# EAGLE design ePaper_1.54_v1.0.1 (EAGLE 9.6.1)

## Sheet 1 of 4: USB & LDO
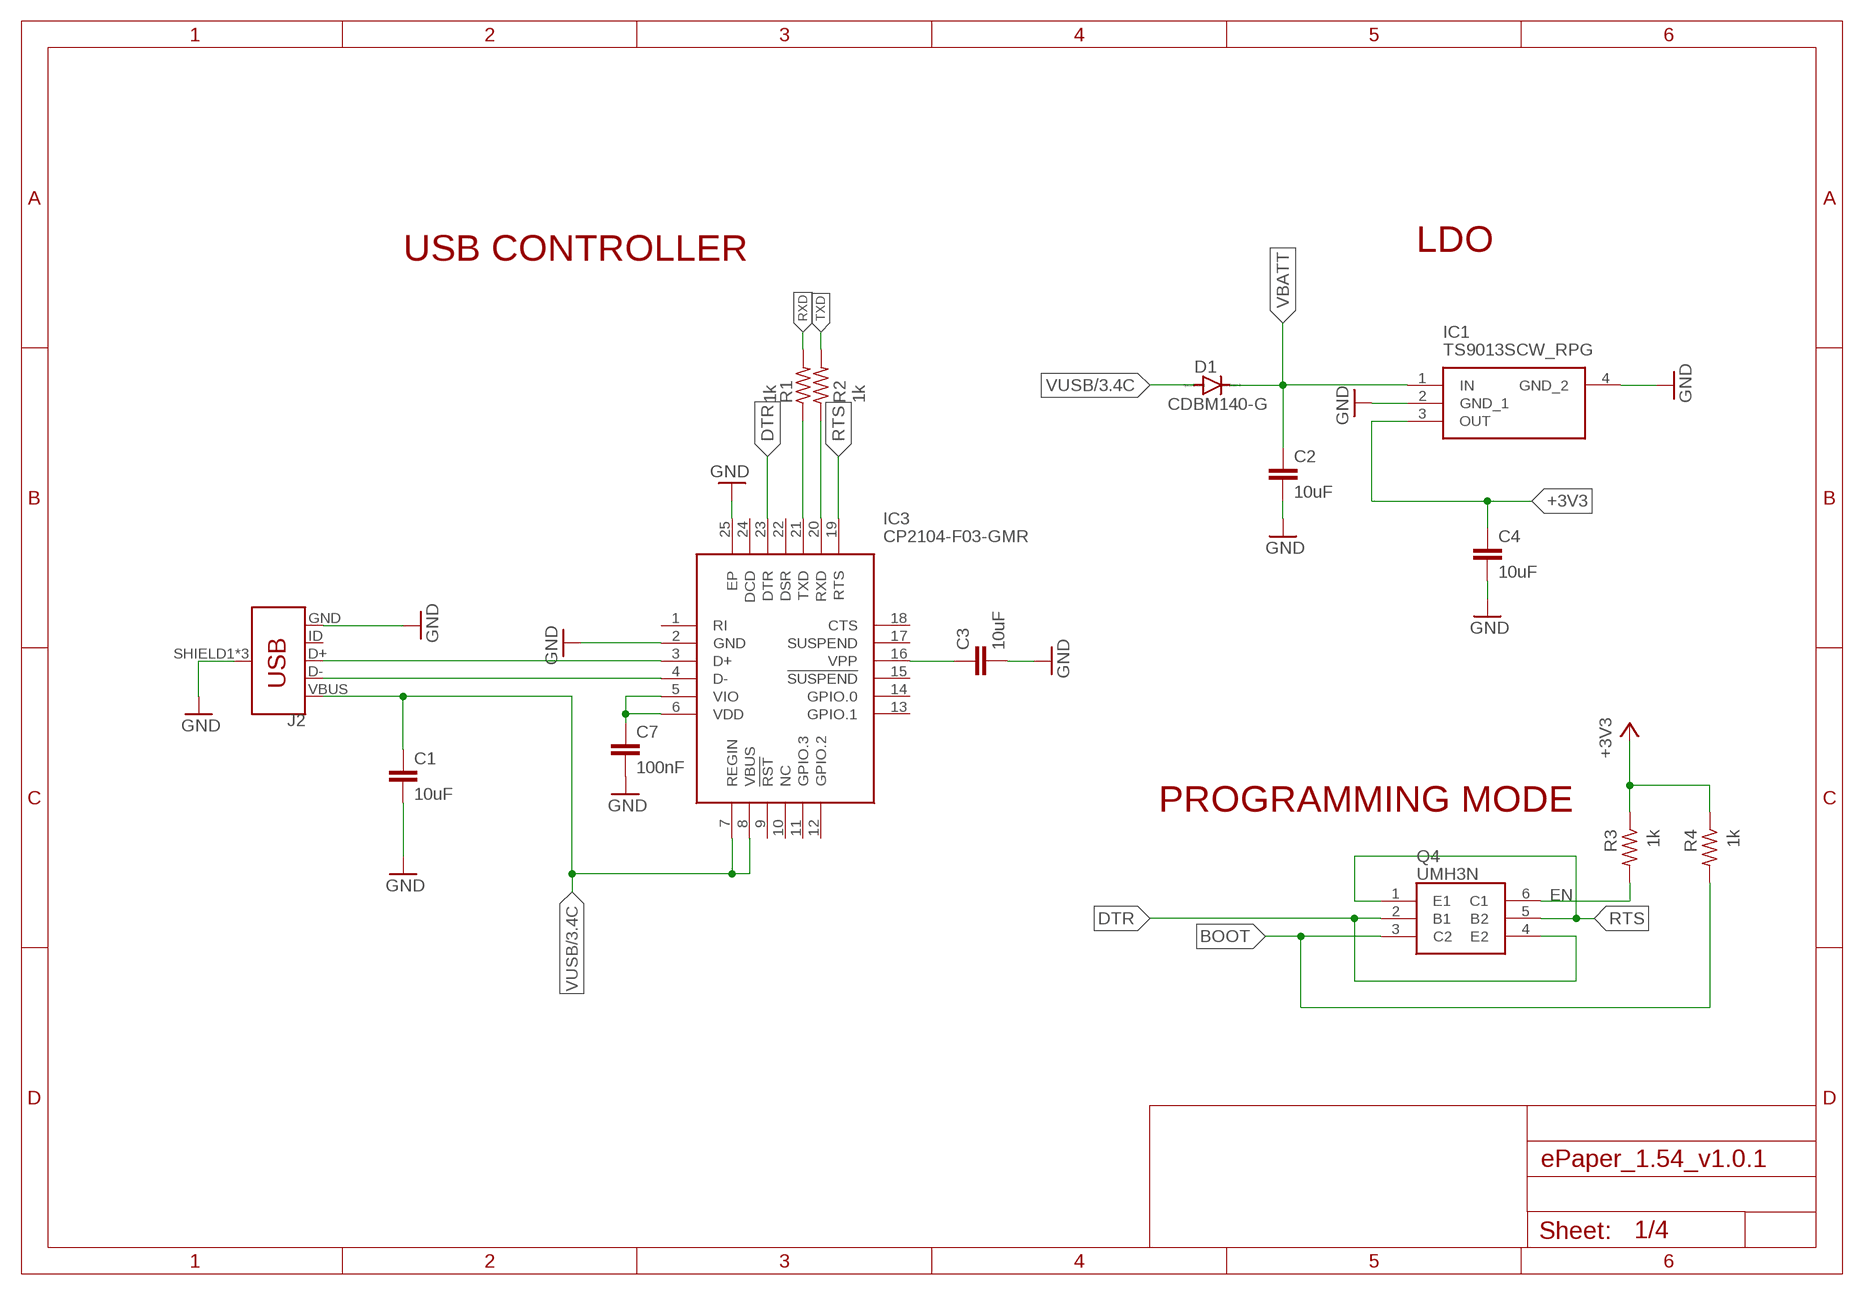
[diagram p0: schematic, sheet 1]

### Parts
C1  10uF  C-EUC0603  [C0603]
C2  10uF  C-EUC0603  [C0603]
C3  10uF  C-EUC0603  [C0603]
C4  10uF  C-EUC0603  [C0603]
C7  100nF  C-EUC0603  [C0603]
D1  CDBM140-G  DIODE-SOD123  [SOD123]
IC1  TS9013SCW_RPG  [SOT230P700X180-4N]
IC3  CP2104-F03-GMR  [QFN50P400X400X80-25N]
J2  USB_MICRO-B_FEMALE-SMT  [USB-B-MICRO-SMD]
Q4  UMH3N  [SOT65P230X110-6N]
R1  1k  R-US_R0603  [R0603]
R2  1k  R-US_R0603  [R0603]
R3  1k  R-US_R0603  [R0603]
R4  1k  R-US_R0603  [R0603]

### Nets
+3V3: C4.1 IC1.3(OUT) R3.1 R4.1 ; also sheet 2,4
BOOT: Q4.3(C2) R4.2 ; also sheet 2
DTR: IC3.23(DTR) Q4.2(B1) Q4.4(E2)
EN: Q4.6(C1) R3.2 ; also sheet 2
GND: C1.2 C2.2 C3.2 C4.2 C7.2 IC1.2(GND_1) IC1.4(GND_2) IC3.2(GND) IC3.25(EP) J2.GND J2.SHIELD1(SHIELD) J2.SHIELD2(SHIELD) J2.SHIELD3(SHIELD) ; also sheet 2,3,4
N$1: IC3.3(D+) J2.D+
N$2: IC3.4(D-) J2.D-
N$3: C3.1 IC3.16(VPP)
N$5: C7.1 IC3.5(VIO) IC3.6(VDD)
N$8: IC3.20(RXD) R2.1
N$9: IC3.21(TXD) R1.1
RTS: IC3.19(RTS) Q4.1(E1) Q4.5(B2)
RXD: R1.2 ; also sheet 2
TXD: R2.2 ; also sheet 2
VBATT: C2.1 D1.C IC1.1(IN) ; also sheet 2,3
VUSB: C1.1 D1.A IC3.7(REGIN) IC3.8(VBUS) J2.VBUS ; also sheet 3
Unconnected: IC3.1(RI) IC3.9(!RST) IC3.10(NC) IC3.11(GPIO.3) IC3.12(GPIO.2) IC3.13(GPIO.1) IC3.14(GPIO.0) IC3.15(!SUSPEND) IC3.17(SUSPEND) IC3.18(CTS) IC3.22(DSR) IC3.24(DCD) J2.ID

### Notes on the sheet
- USB CONTROLLER | LDO
- PROGRAMMING MODE

## Sheet 2 of 4: MICROCONTROLLER
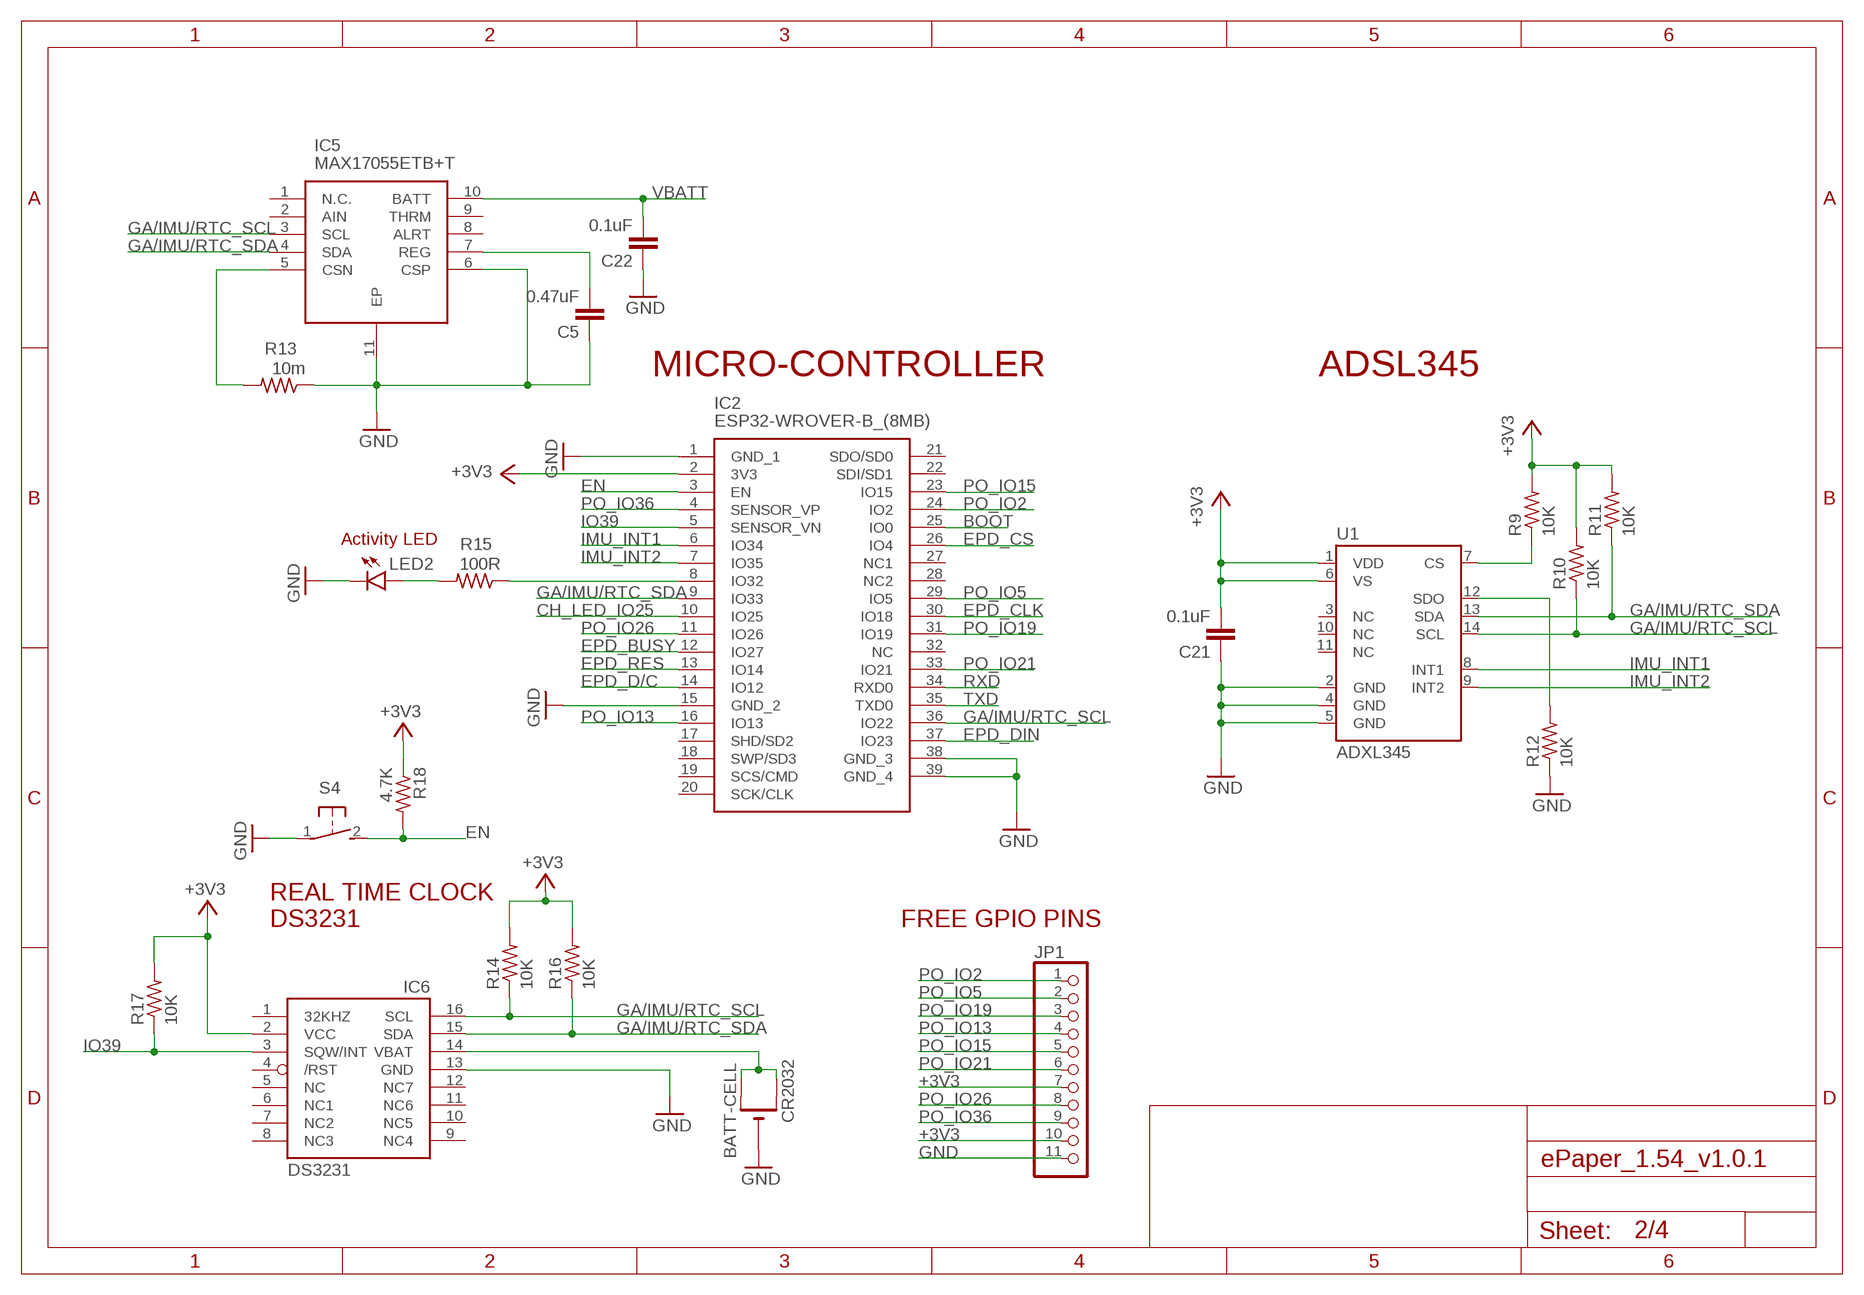
[diagram p1: schematic, sheet 2]

### Parts
BATT-CELL  CR2032  CR2032SMT  [CR2032-SMD]
C5  0.47uF  C-EUC0603  [C0603]
C21  0.1uF  C-EUC0603  [C0603]
C22  0.1uF  C-EUC0603  [C0603]
IC2  ESP32-WROVER-B_(8MB)  [ESP32WROVERIB8MB]
IC5  MAX17055ETB+T  [SON40P250X200X80-11N]
IC6  DS3231/SO  [SO16W]
JP1  PINHD-1X11_2.54-S  [1X11-S]
LED2  LEDCHIPLED_0805  [CHIPLED_0805]
R9  10K  R-US_R0603  [R0603]
R10  10K  R-US_R0603  [R0603]
R11  10K  R-US_R0603  [R0603]
R12  10K  R-US_R0603  [R0603]
R13  10m  R-US_R0603  [R0603]
R14  10K  R-US_R0603  [R0603]
R15  100R  R-US_R0603  [R0603]
R16  10K  R-US_R0603  [R0603]
R17  10K  R-US_R0603  [R0603]
R18  4.7K  R-US_R0603  [R0603]
S4  31-XX  [B3F-31XX]
U1  ADXL345  [LGA14]

### Nets
+3V3: C21.2 IC2.2(3V3) IC6.2(VCC) JP1.7 JP1.10 R9.2 R10.2 R11.2 R14.2 R16.2 R17.2 R18.1 U1.1(VDD) U1.6(VS) ; also sheet 1,4
BOOT: IC2.25(IO0) ; also sheet 1
CH_LED_IO25: IC2.10(IO25) ; also sheet 3
EN: IC2.3(EN) R18.2 S4.2(S) ; also sheet 1
EPD_BUSY: IC2.12(IO27) ; also sheet 4
EPD_CLK: IC2.30(IO18) ; also sheet 4
EPD_CS: IC2.26(IO4) ; also sheet 4
EPD_D/C: IC2.14(IO12) ; also sheet 4
EPD_DIN: IC2.37(IO23) ; also sheet 4
EPD_RES: IC2.13(IO14) ; also sheet 4
GA/IMU/RTC_SCL: IC2.36(IO22) IC5.3(SCL) IC6.16(SCL) R10.1 R14.1 U1.14(SCL)
GA/IMU/RTC_SDA: IC2.9(IO33) IC5.4(SDA) IC6.15(SDA) R11.1 R16.1 U1.13(SDA)
GND: BATT-CELL.- C5.1 C21.1 C22.1 IC2.1(GND_1) IC2.15(GND_2) IC2.38(GND_3) IC2.39(GND_4) IC5.6(CSP) IC5.11(EP) IC6.13(GND) JP1.11 LED2.C R12.1 R13.1 S4.1(P) U1.2(GND) U1.4(GND) U1.5(GND) ; also sheet 1,3,4
IMU_INT1: IC2.6(IO34) U1.8(INT1)
IMU_INT2: IC2.7(IO35) U1.9(INT2)
IO39: IC2.5(SENSOR_VN) IC6.3(SQW/INT) R17.1
N$4: IC5.5(CSN) R13.2
N$7: C5.2 IC5.7(REG)
N$13: R12.2 U1.12(SDO)
N$14: R9.1 U1.7(CS)
N$15: BATT-CELL.+$1(+) BATT-CELL.+$2(+1) IC6.14(VBAT)
N$19: IC2.8(IO32) R15.1
N$21: LED2.A R15.2
PO_IO2: IC2.24(IO2) JP1.1
PO_IO5: IC2.29(IO5) JP1.2
PO_IO13: IC2.16(IO13) JP1.4
PO_IO15: IC2.23(IO15) JP1.5
PO_IO19: IC2.31(IO19) JP1.3
PO_IO21: IC2.33(IO21) JP1.6
PO_IO26: IC2.11(IO26) JP1.8
PO_IO36: IC2.4(SENSOR_VP) JP1.9
RXD: IC2.34(RXD0) ; also sheet 1
TXD: IC2.35(TXD0) ; also sheet 1
VBATT: C22.2 IC5.10(BATT) ; also sheet 1,3
Unconnected: IC2.17(SHD/SD2) IC2.18(SWP/SD3) IC2.19(SCS/CMD) IC2.20(SCK/CLK) IC2.21(SDO/SD0) IC2.22(SDI/SD1) IC2.27(NC1) IC2.28(NC2) IC2.32(NC) IC5.1(N.C.) IC5.2(AIN) IC5.8(ALRT) IC5.9(THRM) IC6.1(32KHZ) IC6.4(/RST) IC6.5(NC) IC6.6(NC1) IC6.7(NC2) IC6.8(NC3) IC6.9(NC4) IC6.10(NC5) IC6.11(NC6) IC6.12(NC7) U1.3(NC) U1.10(NC) U1.11(NC)

### Notes on the sheet
- MICRO-CONTROLLER | ADSL345
- Activity LED
- REAL TIME CLOCK
  DS3231
- FREE GPIO PINS

## Sheet 3 of 4: CHARGING
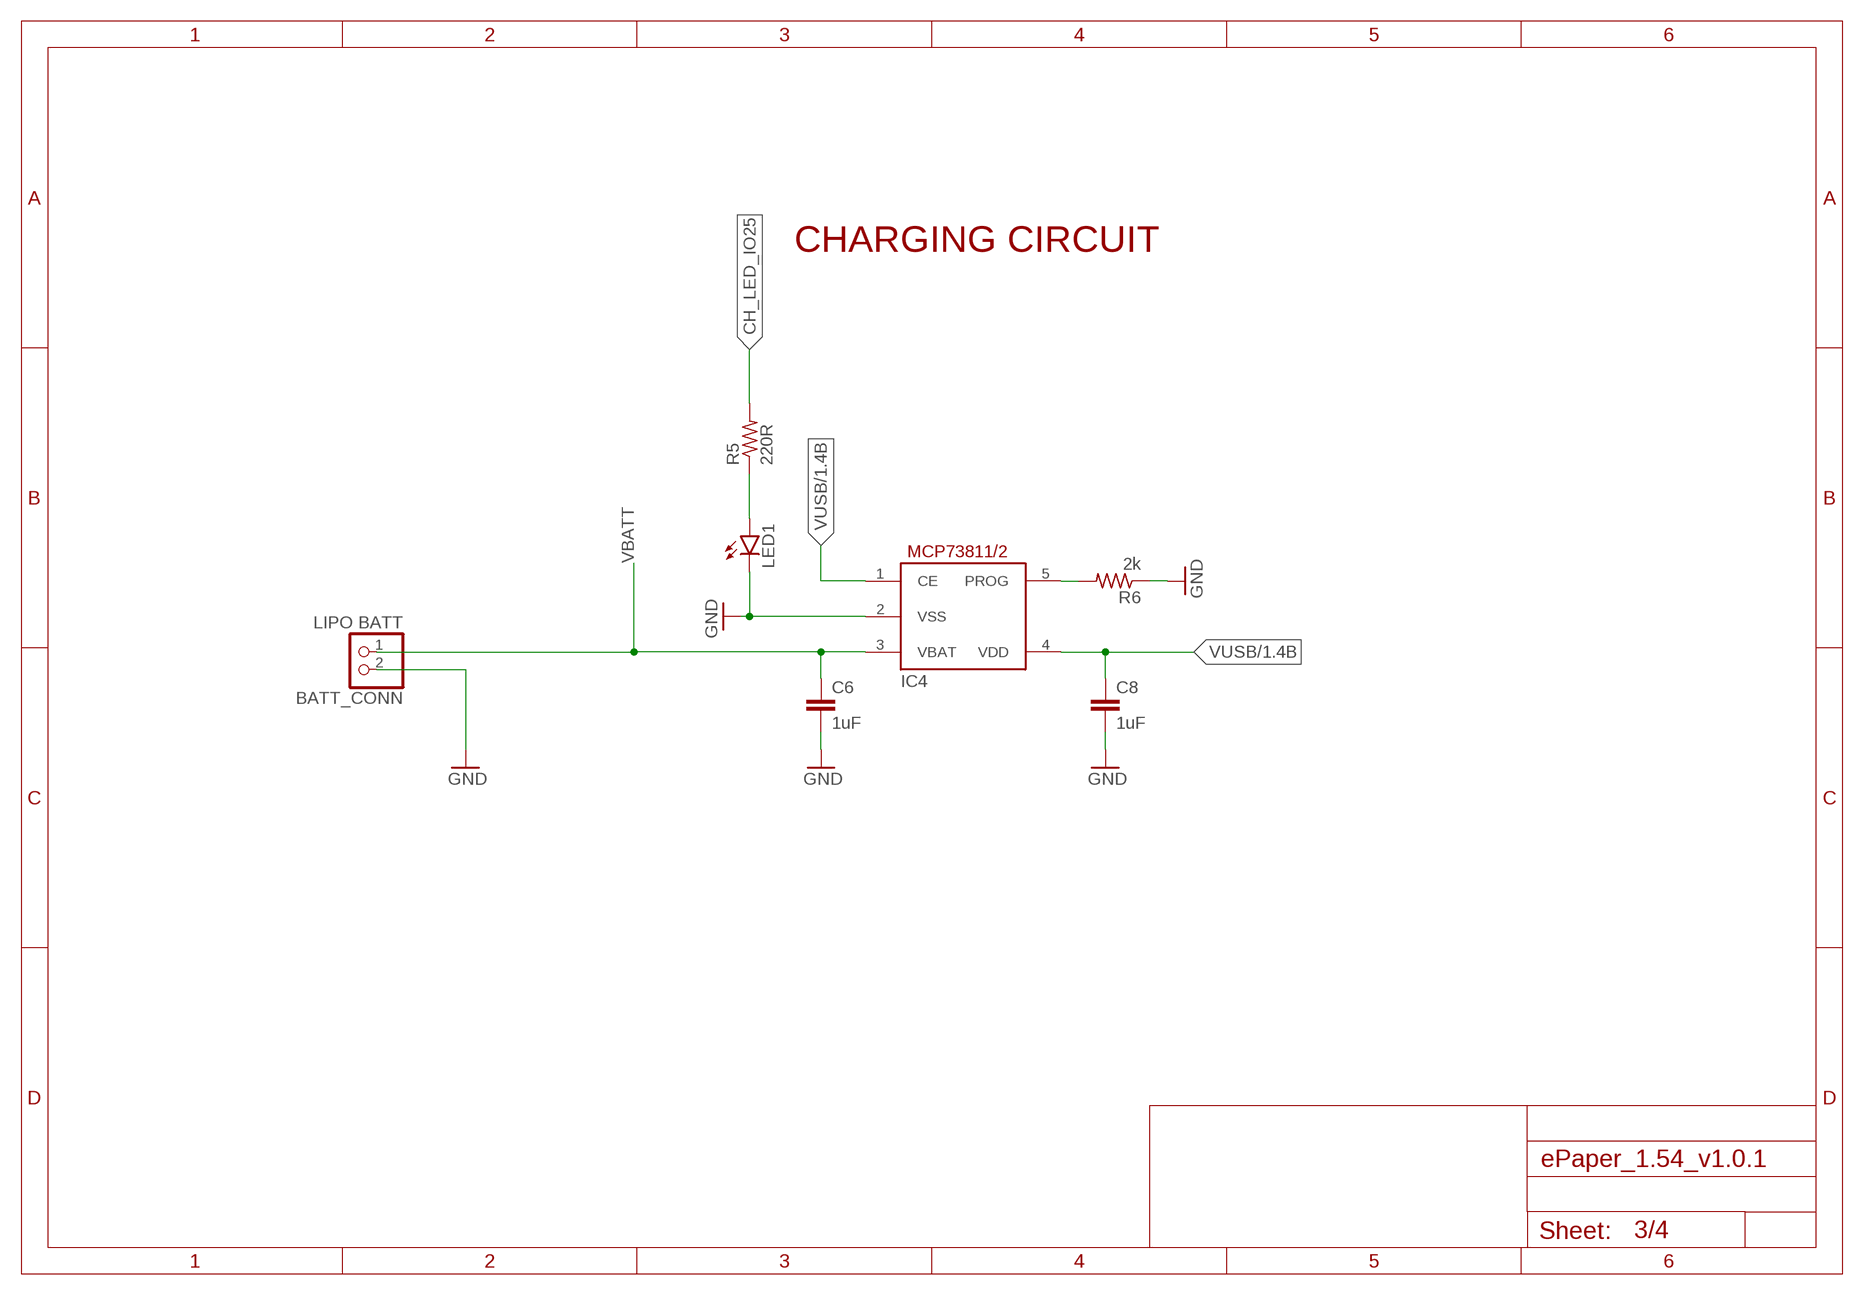
[diagram p2: schematic, sheet 3]

### Parts
BATT_CONN  LIPO BATT  JST_2PIN-THM-RA  [JST-PH-2-THM-RA]
C6  1uF  C-EUC0805  [C0805]
C8  1uF  C-EUC0805  [C0805]
IC4  MCP73811/2  [SOT23-5L]
LED1  LEDCHIPLED_0805  [CHIPLED_0805]
R5  220R  R-US_R0603  [R0603]
R6  2k  R-US_R0603  [R0603]

### Nets
CH_LED_IO25: R5.2 ; also sheet 2
GND: BATT_CONN.2 C6.2 C8.2 IC4.2(VSS) LED1.C R6.1 ; also sheet 1,2,4
N$6: IC4.5(PROG) R6.2
N$10: LED1.A R5.1
VBATT: BATT_CONN.1 C6.1 IC4.3(VBAT) ; also sheet 1,2
VUSB: C8.1 IC4.1(CE) IC4.4(VDD) ; also sheet 1

### Notes on the sheet
- CHARGING CIRCUIT

## Sheet 4 of 4: DISPLAY
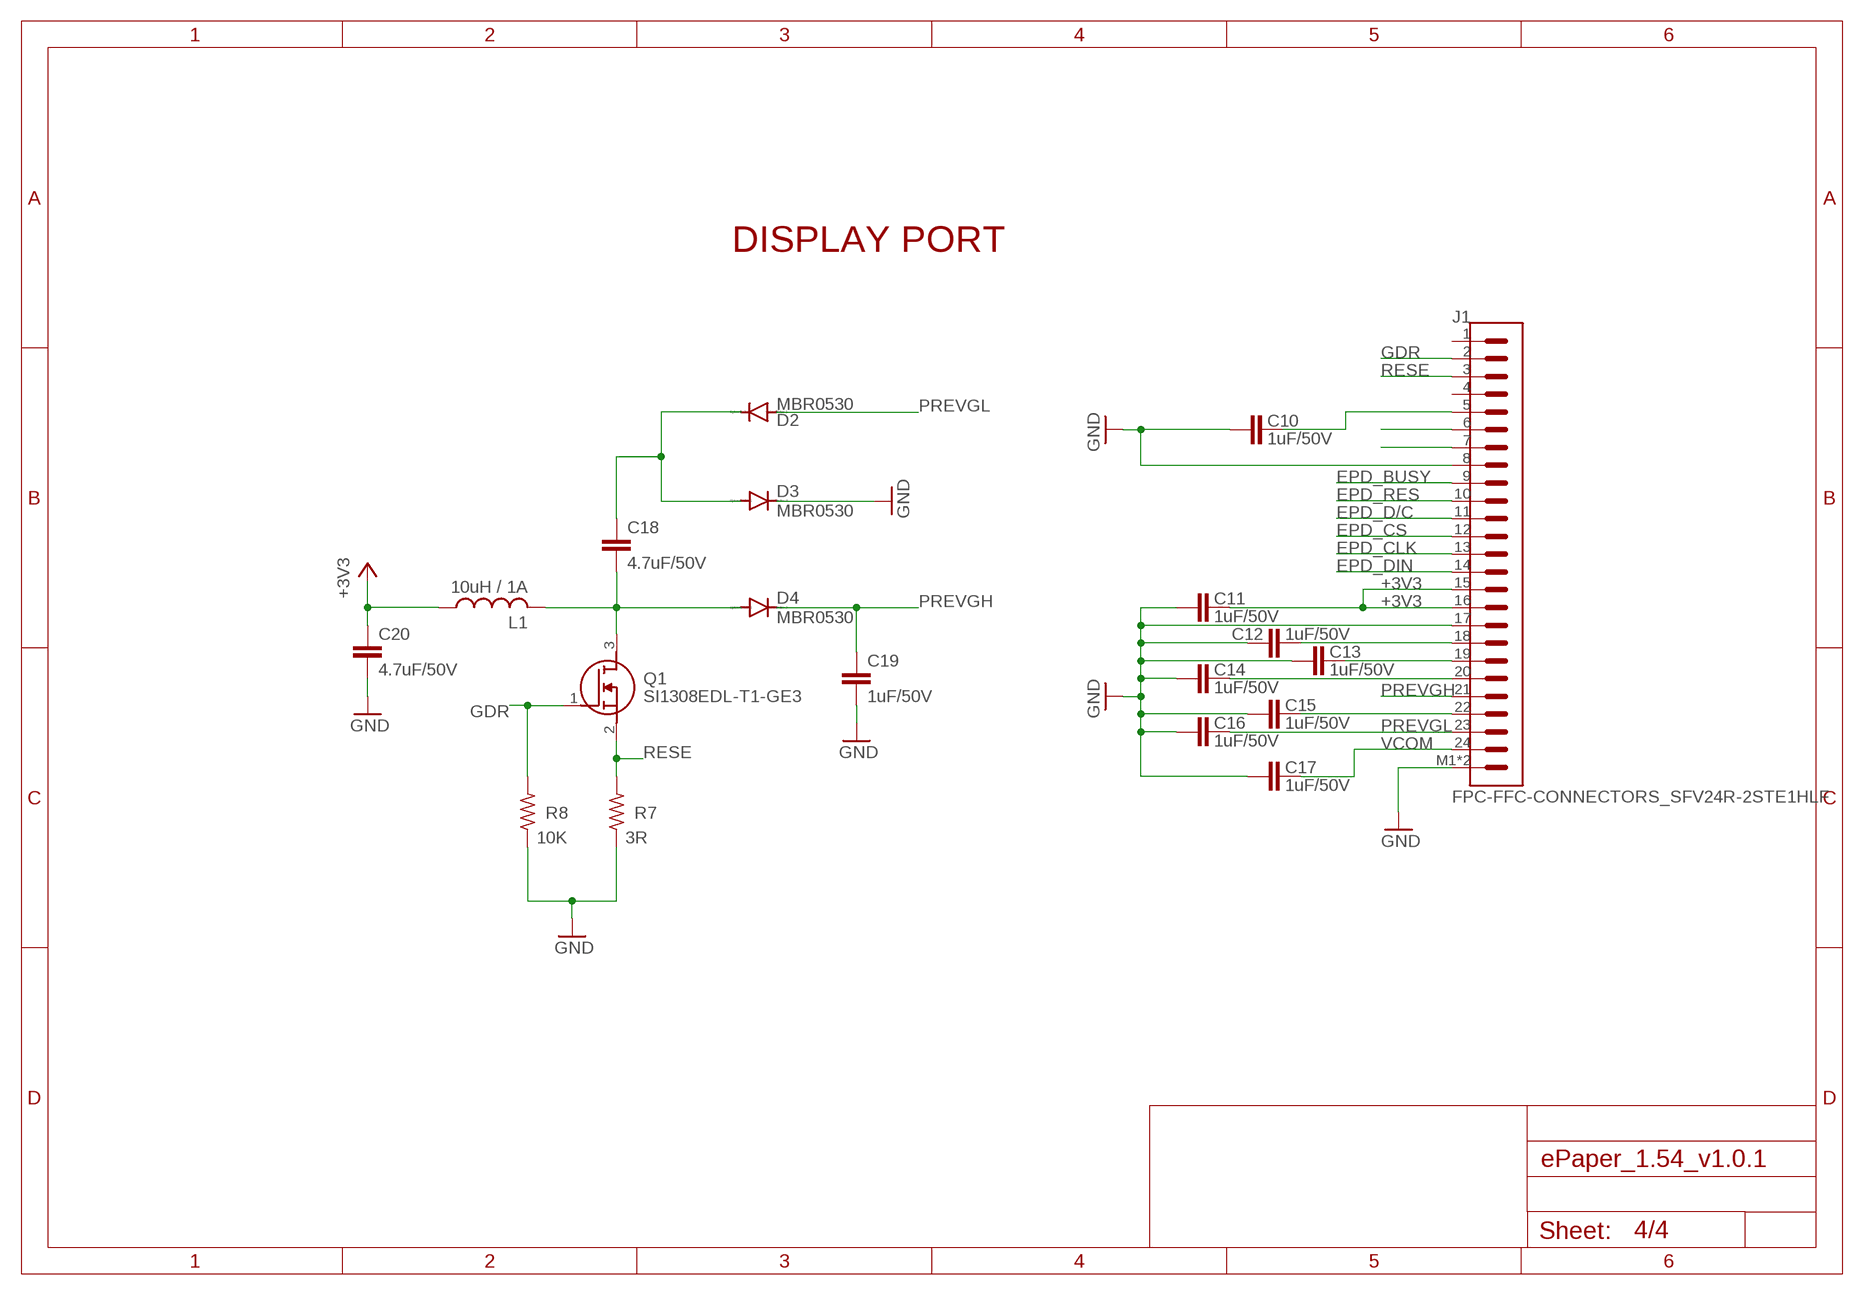
[diagram p3: schematic, sheet 4]

### Parts
C10  1uF/50V  C-EUC0805  [C0805]
C11  1uF/50V  C-EUC0805  [C0805]
C12  1uF/50V  C-EUC0805  [C0805]
C13  1uF/50V  C-EUC0805  [C0805]
C14  1uF/50V  C-EUC0805  [C0805]
C15  1uF/50V  C-EUC0805  [C0805]
C16  1uF/50V  C-EUC0805  [C0805]
C17  1uF/50V  C-EUC0805  [C0805]
C18  4.7uF/50V  C-EUC0805  [C0805]
C19  1uF/50V  C-EUC0805  [C0805]
C20  4.7uF/50V  C-EUC0805  [C0805]
D2  MBR0530  MBR0520LT  [SOD123]
D3  MBR0530  MBR0520LT  [SOD123]
D4  MBR0530  MBR0520LT  [SOD123]
J1  FPC-FFC-CONNECTORS_SFV24R-2STE1HLF  [FPC-FFC-CONNECTORS_SFV24R-2STE1HLF]
L1  10uH / 1A  L-USL3225P  [L3225P]
Q1  SI1308EDL-T1-GE3  [SOT65P210X110-3N]
R7  3R  R-US_R0603  [R0603]
R8  10K  R-US_R0603  [R0603]

### Nets
+3V3: C11.2 C20.2 J1.15 J1.16 L1.1 ; also sheet 1,2
EPD_BUSY: J1.9 ; also sheet 2
EPD_CLK: J1.13 ; also sheet 2
EPD_CS: J1.12 ; also sheet 2
EPD_D/C: J1.11 ; also sheet 2
EPD_DIN: J1.14 ; also sheet 2
EPD_RES: J1.10 ; also sheet 2
GDR: J1.2 Q1.1(G) R8.2
GND: C10.1 C11.1 C12.1 C13.1 C14.1 C15.1 C16.1 C17.1 C19.1 C20.1 D3.C J1.8 J1.17 J1.M1(SHIELD) J1.M2(SHIELD) R7.1 R8.1 ; also sheet 1,2,3
N$12: C18.1 D4.A L1.2 Q1.3(D)
N$16: C10.2 J1.5
N$17: J1.6
N$18: J1.7
N$20: C18.2 D2.C D3.A
N$29: C12.2 J1.18
N$30: C13.2 J1.19
N$31: C14.2 J1.20
N$33: C15.2 J1.22
PREVGH: C19.2 D4.C J1.21
PREVGL: C16.2 D2.A J1.23
RESE: J1.3 Q1.2(S) R7.2
VCOM: C17.2 J1.24
Unconnected: J1.1 J1.4

### Notes on the sheet
- DISPLAY PORT

## Library data of the parts
BATT-CELL = adafruit:CR2032
BATT_CONN = adafruit:JST_2PIN: JST 2-Pin Connectors of various flavors SMT-RA (S2B-PH-SM4) 4UConnector #17311 SMT (B2B-PH-SM4) THM-RA (S2B-PH) THM (B2B-PH)
C1-C8 C10-C22 = rcl:C-EU: CAPACITOR, European symbol; SPICEPREFIX: C
D1 = diode:DIODE-: DIODE
D2-D4 = diode:MBR0520LT: SCHOTTKY BARRIER RECTIFIER Source: http://onsemi.com .. MBR0520LT1-D.pdf
IC1 = TS9013SCW_RPG:TS9013SCW_RPG: LDO Voltage Regulators 0.5A 3.3V CMOS LDO Source: Datasheet <https://ms.componentsearchengine.com/Datasheets/34/TS9013SCW RPG.pdf>; DESCRIPTION: LDO Voltage Regulators 0.5A 3.3V CMOS LDO; HEIGHT: 1.8mm; MANUFACTURER_NAME: Taiwan Semiconductor; MANUFACTURER_PART_NUMBER: TS9013SCW RPG
IC2 = ESP32-WROVER-B_(8MB):ESP32-WROVER-B_(8MB): WiFi Modules (802.11) SMD Module, ESP32-D0WD, 64Mbits PSRAM, 128Mbits SPI flash, PCB Antenna Source: Datasheet <https://www.mouser.es/datasheet/2/891/esp32-wrover-b_datasheet_en-1384674.pdf>; DESCRIPTION: WiFi Modules (802.11) SMD Module, ESP32-D0WD, 64Mbits PSRAM, 128Mbits SPI flash, PCB Antenna; HEIGHT: 3.4mm; MANUFACTURER_NAME: Espressif; MANUFACTURER_PART_NUMBER: ESP32-WROVER-B (16MB); MOUSER_PART_NUMBER: 356-ESP32-WROB(16MB)
IC3 = CP2104-F03-GMR:CP2104-F03-GMR: USB-to-UART 1-CH 576byte FIFO 3.3V Automotive 24-Pin QFN EP T/R Source: Datasheet <https://www.silabs.com/documents/public/data-sheets/cp2104.pdf>; DESCRIPTION: USB-to-UART 1-CH 576byte FIFO 3.3V Automotive 24-Pin QFN EP T/R; HEIGHT: 0.8mm; MANUFACTURER_NAME: Silicon Labs; MANUFACTURER_PART_NUMBER: CP2104-F03-GMR; MOUSER_PART_NUMBER: 634-CP2104-F03-GMR; MOUSER_PRICE-STOCK: https://www.mouser.com/Search/Refine.aspx?Keyword=634-CP2104-F03-GMR
IC4 = adafruit:MCP73811/2: MCP73811 and MCP73812 Simple, Miniature Single-Cell, Fully Integrated Li-Ion / Li-Polymer Charge Management Controllers SOT-23-5 package, no indicator LED but with adjustable current, small and very inexpensive
IC5 = MAX17055ETB+T:MAX17055ETB+T: Battery Management Stand-Alone Model Gauge m5 Fuel Gauge Source: Datasheet <https://datasheets.maximintegrated.com/en/ds/MAX17055.pdf>; DESCRIPTION: Battery Management Stand-Alone Model Gauge m5 Fuel Gauge; HEIGHT: 0.8mm; MANUFACTURER_NAME: Maxim Integrated; MANUFACTURER_PART_NUMBER: MAX17055ETB+T; MOUSER_PART_NUMBER: 700-MAX17055ETB+T; MOUSER_PRICE-STOCK: https://www.mouser.com/Search/Refine.aspx?Keyword=700-MAX17055ETB%2BT; RS_PART_NUMBER: 1913808; RS_PRICE-STOCK: http://uk.rs-online.com/web/p/products/1913808
IC6 = adafruit:DS3231
J1 = SFV24R-2STE1HLF-TOP:FPC-FFC-CONNECTORS_SFV24R-2STE1HLF: CONN FFC BOTTOM 24POS 0.50MM R/A Manufacturer's datasheet <https://cdn.amphenol-icc.com/media/wysiwyg/files/documentation/gs-12-645.pdf>; CREATED_BY: Abrar Ashraf; DIGIKEY_PARTNO: 609-4321-2-ND; MANUFACTURER: Amphenol ICC (FCI); MPN: SFV24R-2STE1HLF
J2 = SparkFun-Connectors:USB_MICRO-B: USB Type Micro-B Connector Male/female and PTH/SMT variants SparkFun Products: SparkFun microB USB Breakout <https://www.sparkfun.com/products/12035> SparkFun USB microB Plug Breakout <https://www.sparkfun.com/products/10031> SparkFun ESP8266 Thing <https://www.sparkfun.com/products/13231>; PROD_ID: CONN-11752
JP1 = pinhead-2:PINHD-1X11: PIN HEADER
L1 = rcl:L-US: INDUCTOR, American symbol; SPICEPREFIX: L
LED1 LED2 = led:LED: LED OSRAM: - CHIPLED LG R971, LG N971, LY N971, LG Q971, LY Q971, LO R971, LY R971 LH N974, LH R974 LS Q976, LO Q976, LY Q976 LO Q996 - Hyper CHIPLED LW Q18S LB Q993, LB Q99A, LB R99A - SideLED LS A670, LO A670, LY A670, LG A670, LP A670 LB A673, LV A673, LT A673, LW A673 LH A674 LY A675 LS A676, LA A676, LO A676, LY A676, LW A676 LS A679, LY A679, LG A679 - Hyper Micro SIDELED® LS Y876, LA Y876, LO Y876, LY Y876 LT Y87S - SmartLED LW L88C, LW L88S LB L89C, LB L89S, LG L890 LS L89K, LO L89K, LY L89K LS L896, LA L896, LO L896, LY L896 - TOPLED LS T670, LO T670, LY T670, LG T670, LP T670 LSG T670, LSP T670, LSY T670, LOP T670, LYG T670 LG T671, LOG T671, LSG T671 LB T673, LV T673, LT T673, LW T673 LH T674 LS T676, LA T676, LO T676, LY T676, LB T676, LH T676, LSB T676, LW T676 LB T67C, LV T67C, LT T67C, LS T67K, LO T67K, LY T67K, LW E67C LS E67B, LA E67B, LO E67B, LY E67B, LB E67C, LV E67C, LT E67C LW T67C LS T679, LY T679, LG T679 LS T770, LO T770, LY T770, LG T770, LP T770 LB T773, LV T773, LT T773, LW T773 LH T774 LS E675, LA E675, LY E675, LS T675 LS T776, LA T776, LO T776, LY T776, LB T776 LHGB T686 LT T68C, LB T68C - Hyper Mini TOPLED® LB M676 - Mini TOPLED Santana® LG M470 LS M47K, LO M47K, LY M47K Source: http://www.osram.convergy.de LUXEON: - LUMILED® LXK2-PW12-R00, LXK2-PW12-S00, LXK2-PW14-U00, LXK2-PW14-V00 LXK2-PM12-R00, LXK2-PM12-S00, LXK2-PM14-U00 LXK2-PE12-Q00, LXK2-PE12-R00, LXK2-PE12-S00, LXK2-PE14-T00, LXK2-PE14-U00 LXK2-PB12-K00, LXK2-PB12-L00, LXK2-PB12-M00, LXK2-PB14-N00, LXK2-PB14-P00, LXK2-PB14-Q00 LXK2-PR12-L00, LXK2-PR12-M00, LXK2-PR14-Q00, LXK2-PR14-R00 LXK2-PD12-Q00, LXK2-PD12-R00, LXK2-PD12-S00 LXK2-PH12-R00, LXK2-PH12-S00 LXK2-PL12-P00, LXK2-PL12-Q00, LXK2-PL12-R00 Source: www.luxeon.com KINGBRIGHT: KA-3528ASYC Source: www.kingbright.com
Q1 = Si1308EDL-T1-GE3:SI1308EDL-T1-GE3: MOSFET N-Ch 30V 1.5A TrenchFET SC70 Vishay Si1308EDL-T1-GE3 N-channel MOSFET Transistor, 1.5 A, 30 V, 3-Pin SC-70 Source: Datasheet <https://componentsearchengine.com/Datasheets/1/SI1308EDL-T1-GE3.pdf>; ALLIED_NUMBER: 70459651; ALLIED_PRICE-STOCK: https://www.alliedelec.com/siliconix-vishay-si1308edl-t1-ge3/70459651/; DESCRIPTION: MOSFET N-Ch 30V 1.5A TrenchFET SC70 Vishay Si1308EDL-T1-GE3 N-channel MOSFET Transistor, 1.5 A, 30 V, 3-Pin SC-70; HEIGHT: 1.1mm; MANUFACTURER_NAME: Vishay; MANUFACTURER_PART_NUMBER: Si1308EDL-T1-GE3; MOUSER_PART_NUMBER: 78-SI1308EDL-T1-GE3; MOUSER_PRICE-STOCK: https://www.mouser.com/Search/Refine.aspx?Keyword=78-SI1308EDL-T1-GE3; RS_PART_NUMBER: 7879121P; RS_PRICE-STOCK: http://uk.rs-online.com/web/p/products/7879121P
Q4 = UMH3N:UMH3N: 2 NPN pre-biased (Dual) 100mA 50V SC-70-6(SOT-363) Digital Transistors RoHS Source: Datasheet <https://datasheet.lcsc.com/szlcsc/Changjiang-Electronics-Tech-CJ-UMH3N_C62892.pdf>; DESCRIPTION: 2 NPN pre-biased (Dual) 100mA 50V SC-70-6(SOT-363) Digital Transistors RoHS; HEIGHT: 1.1mm; MANUFACTURER_NAME: Changjiang Electronics Tech (CJ); MANUFACTURER_PART_NUMBER: UMH3N
R1-R18 = rcl:R-US_: RESISTOR, American symbol; SPICEPREFIX: R
S4 = switch-omron:31-XX: OMRON SWITCH; MPN: B3F-3100; OC_FARNELL: 959704; OC_NEWARK: 36M3582
U1 = SparkFun-Sensors:ADXL345: 3-axis SPI/I2C 2/4/8/16g accelerometer

## Board
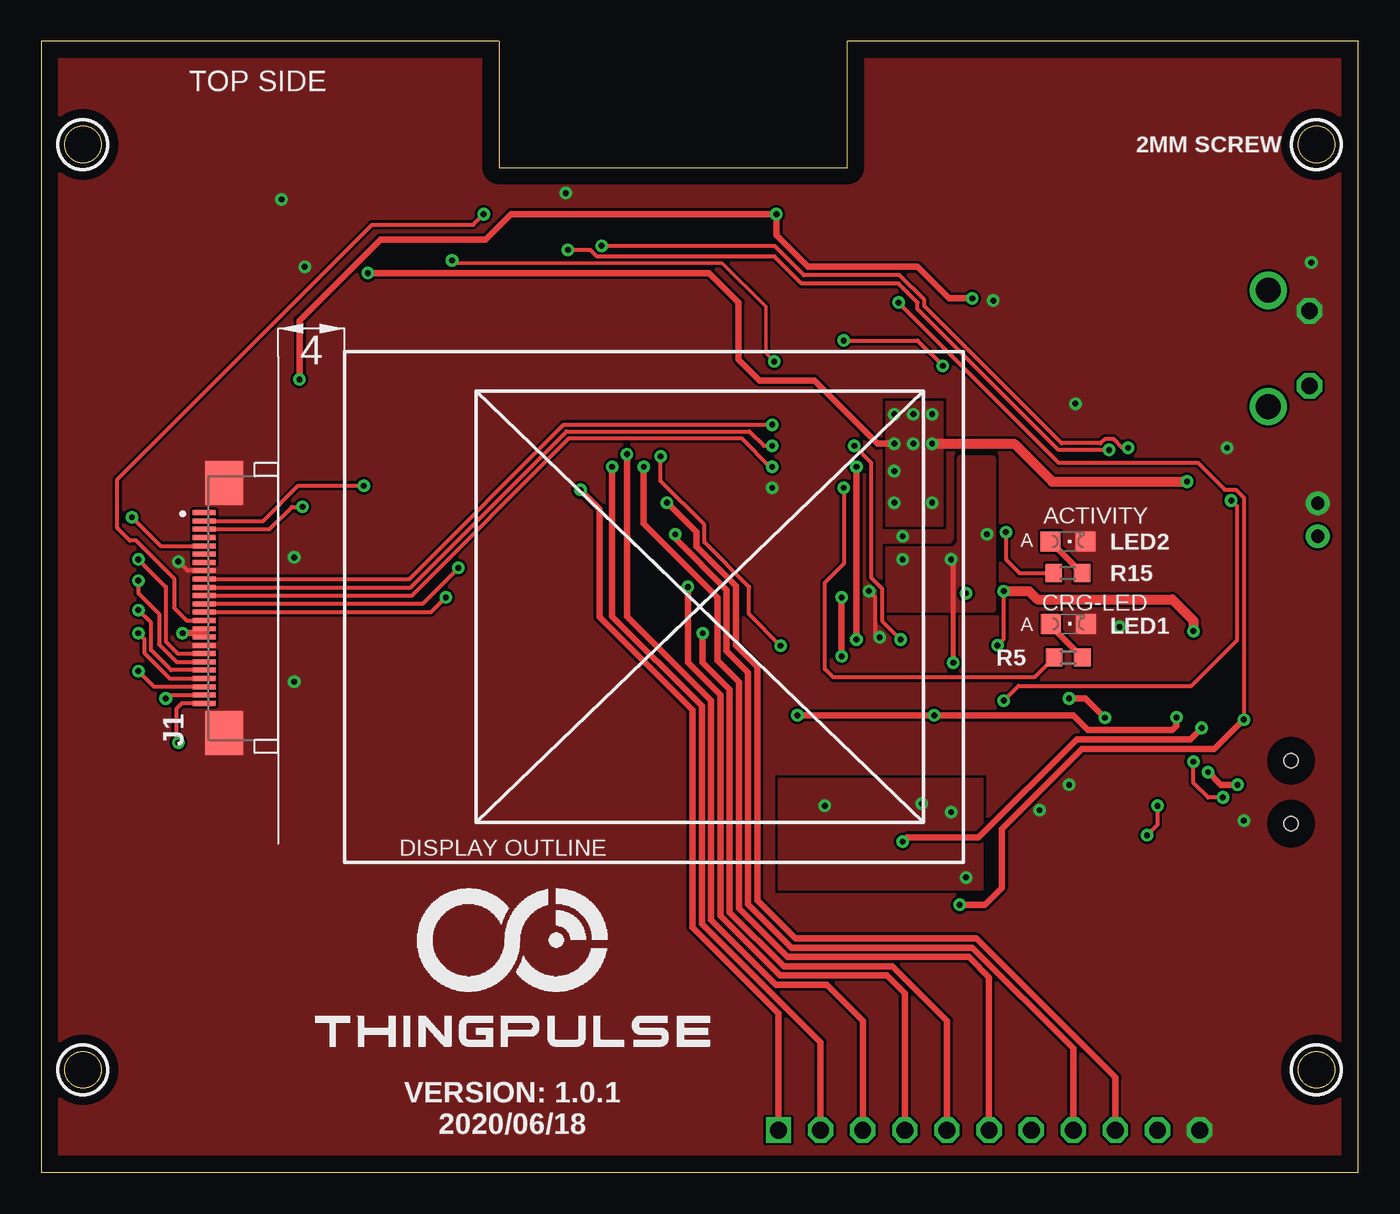
[diagram p4: board, top side]
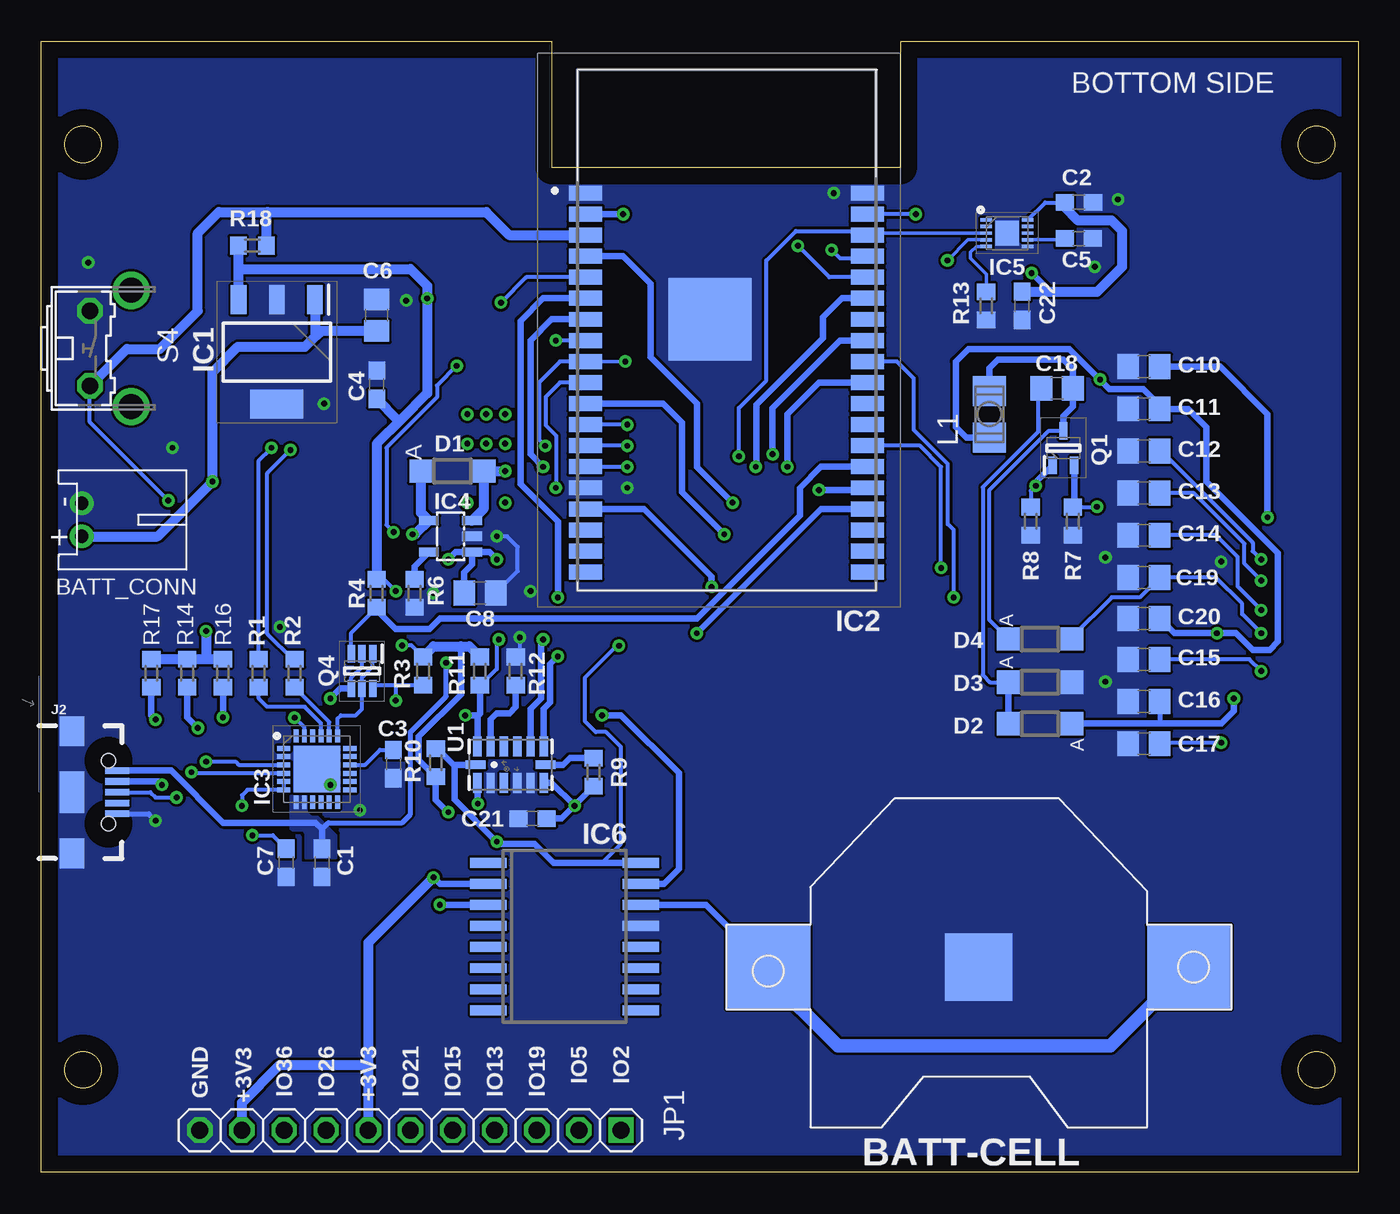
[diagram p5: board, bottom side, seen from below]

Size 79.4 x 68.2 mm. Coordinates in mm from the lower left corner, seen from the top.
Outline: 79.4,68.2 48.6,68.2 48.6,60.6 27.6,60.6 27.6,68.2 0,68.2 0,0 79.4,0 79.4,68.2
Outline: circle at 76.89,6.18 radius 1.1
Outline: circle at 76.89,61.99 radius 1.1
Outline: circle at 2.5,6.18 radius 1.1
Outline: circle at 2.5,61.99 radius 1.1
Copper layers (1*16): Top 0.035mm / dielectric 1.5mm / Bottom 0.035mm
Design rules "default *": minimum track width 6mil, minimum drill 0.3mm, track to track 6mil, track to pad 6mil, pad to pad 6mil, via to via 6mil, smd to smd 6mil, copper to edge 40mil, drill to drill 6mil, minimum pad ring 10mil, minimum via ring 8mil, stop-mask expansion 4mil, vias tented up to drill 0mil, thermal gap 10mil

### Footprints (pad centres in the part's own frame; a part is rotated, then mirrored left to right if it is on the bottom)
CR2032-SMD = smd 5.08 x 5.08: +$1 -12.7,0; +$2 12.7,0 | smd 4.064 x 4.064: - 0,0
JST-PH-2-THM-RA = drill 0.8 pad 1.422: 1 1,0; 2 -1,0
C0603 = smd 1.1 x 1: 1 -0.85,0; 2 0.85,0
C0805 = smd 1.3 x 1.5: 1 -0.95,0; 2 0.95,0
SOD123 = smd 1.4 x 1.4: A 1.9,0; C -1.9,0
SOT230P700X180-4N = smd 1.75 x 0.95: 1 -3.15,2.3; 2 -3.15,0; 3 -3.15,-2.3 | smd 1.75 x 3.2: 4 3.15,0
ESP32WROVERIB8MB = smd 2 x 0.9: 1 -7.85,8.26; 2 -7.85,6.99; 3 -7.85,5.72; 4 -7.85,4.45; 5 -7.85,3.18; 6 -7.85,1.91; 7 -7.85,0.64; 8 -7.85,-0.63; 9 -7.85,-1.9; 10 -7.85,-3.17; 11 -7.85,-4.44; 12 -7.85,-5.71; 13 -7.85,-6.98; 14 -7.85,-8.25; 15 -7.85,-9.52; 16 -7.85,-10.79; 17 -7.85,-12.06; 18 -7.85,-13.33; 19 -7.85,-14.6; 20 9.15,-14.6; 21 9.15,-13.33; 22 9.15,-12.06; 23 9.15,-10.79; 24 9.15,-9.52; 25 9.15,-8.25; 26 9.15,-6.98; 27 9.15,-5.71; 28 9.15,-4.44; 29 9.15,-3.17; 30 9.15,-1.9; 31 9.15,-0.63; 32 9.15,0.64; 33 9.15,1.91; 34 9.15,3.18; 35 9.15,4.45; 36 9.15,5.72; 37 9.15,6.99; 38 9.15,8.26 | smd 5 x 5: 39 -0.35,0.64
QFN50P400X400X80-25N = smd 0.8 x 0.3: 1 -2,1.25; 2 -2,0.75; 3 -2,0.25; 4 -2,-0.25; 5 -2,-0.75; 6 -2,-1.25; 13 2,-1.25; 14 2,-0.75; 15 2,-0.25; 16 2,0.25; 17 2,0.75; 18 2,1.25 | smd 0.3 x 0.8: 7 -1.25,-2; 8 -0.75,-2; 9 -0.25,-2; 10 0.25,-2; 11 0.75,-2; 12 1.25,-2; 19 1.25,2; 20 0.75,2; 21 0.25,2; 22 -0.25,2; 23 -0.75,2; 24 -1.25,2 | smd 2.8 x 2.8: 25 0,0
SOT23-5L = smd 0.55 x 1.2: 1 -0.95,-1.3; 2 0,-1.3; 3 0.95,-1.3; 4 0.95,1.3; 5 -0.95,1.3
SON40P250X200X80-11N = smd 0.7 x 0.2: 1 -1.25,0.8; 2 -1.25,0.4; 3 -1.25,0; 4 -1.25,-0.4; 5 -1.25,-0.8; 6 1.25,-0.8; 7 1.25,-0.4; 8 1.25,0; 9 1.25,0.4; 10 1.25,0.8 | smd 1.4 x 1.5: 11 0,0
SO16W = smd 0.6 x 2.2: 1 -4.445,-4.6; 2 -3.175,-4.6; 3 -1.905,-4.6; 4 -0.635,-4.6; 5 0.635,-4.6; 6 1.905,-4.6; 7 3.175,-4.6; 8 4.445,-4.6; 9 4.445,4.6; 10 3.175,4.6; 11 1.905,4.6; 12 0.635,4.6; 13 -0.635,4.6; 14 -1.905,4.6; 15 -3.175,4.6; 16 -4.445,4.6
FPC-FFC-CONNECTORS_SFV24R-2STE1HLF = smd 0.3 x 1.4: 1 5.75,1.23; 2 5.25,1.23; 3 4.75,1.23; 4 4.25,1.23; 5 3.75,1.23; 6 3.25,1.23; 7 2.75,1.23; 8 2.25,1.23; 9 1.75,1.23; 10 1.25,1.23; 11 0.75,1.23; 12 0.25,1.23; 13 -0.25,1.23; 14 -0.75,1.23; 15 -1.25,1.23; 16 -1.75,1.23; 17 -2.25,1.23; 18 -2.75,1.23; 19 -3.25,1.23; 20 -3.75,1.23; 21 -4.25,1.23; 22 -4.75,1.23; 23 -5.25,1.23; 24 -5.75,1.23 | smd 2.65 x 2.3: M1 -7.525,0.02; M2 7.525,0.02
USB-B-MICRO-SMD = smd 1.45 x 0.4: D+ 2.725,0; D- 2.725,0.65; GND 2.725,-1.3; ID 2.725,-0.65; VBUS 2.725,1.3 | smd 1.5 x 1.8: SHIELD1 0,3.685; SHIELD2 0,-3.685 | smd 1.5 x 2.5: SHIELD3 0,0 | hole 0.85: 2.2,1.9; 2.2,-1.9
1X11-S = drill 1.016 square: 1 -12.7,0 | drill 1.016 octagon: 2 -10.16,0; 3 -7.62,0; 4 -5.08,0; 5 -2.54,0; 6 0,0; 7 2.54,0; 8 5.08,0; 9 7.62,0; 10 10.16,0; 11 12.7,0
L3225P = smd 1.8 x 2: 1 -1.4,0; 2 1.4,0
CHIPLED_0805 = smd 1.2 x 1.2: A 0,-1.05; C 0,1.05
SOT65P210X110-3N = smd 1.05 x 0.5: 1 -1.05,0.65; 2 -1.05,-0.65; 3 1.05,0
SOT65P230X110-6N = smd 1.05 x 0.45: 1 -1.05,0.65; 2 -1.05,0; 3 -1.05,-0.65; 4 1.05,-0.65; 5 1.05,0; 6 1.05,0.65
R0603 = smd 1 x 1.1: 1 -0.85,0; 2 0.85,0
B3F-31XX = drill 1.016 octagon: 1 -2.261,-1.245; 2 2.261,-1.245 | drill 1.499 pad 2.159: 3 -3.505,1.245; 4 3.505,1.245
LGA14 = smd 0.5 x 1.2: 1 2,1.1; 2 1.2,1.1; 3 0.4,1.1; 4 -0.4,1.1; 5 -1.2,1.1; 6 -2,1.1; 8 -2,-1.1; 9 -1.2,-1.1; 10 -0.4,-1.1; 11 0.4,-1.1; 12 1.2,-1.1; 13 2,-1.1 | smd 1.2 x 0.5: 7 -2.1,0; 14 2.1,0

### Placement (x,y rotation side)
BATT-CELL  22.87,12.38 180 bottom
BATT_CONN  76.97,39.35 270 bottom
C1  62.48,18.67 270 bottom
C2  16.83,58.49 0 bottom
C3  58.18,24.62 270 bottom
C4  59.18,47.5 90 bottom
C5  16.84,56.32 180 bottom
C6  59.18,51.69 90 bottom
C7  64.64,18.67 270 bottom
C8  52.96,34.93 0 bottom
C10  12.91,48.58 0 bottom
C11  12.91,46.04 0 bottom
C12  12.91,43.5 0 bottom
C13  12.91,40.96 0 bottom
C14  12.91,38.42 0 bottom
C15  12.91,30.93 0 bottom
C16  12.91,28.39 0 bottom
C17  12.91,25.85 0 bottom
C18  18.15,47.28 180 bottom
C19  12.91,35.88 0 bottom
C20  12.91,33.4 0 bottom
C21  49.78,21.34 0 bottom
C22  20.27,52.26 90 bottom
D1  54.61,42.29 180 bottom
D2  19.18,27.06 0 bottom
D3  19.18,29.56 180 bottom
D4  19.18,32.16 180 bottom
IC1  65.21,49.47 270 bottom
IC2  38.73,50.8 0 bottom
IC3  62.79,24.32 0 bottom
IC4  54.74,38.35 90 bottom
IC5  21.17,56.64 0 bottom
IC6  47.85,14.22 270 bottom
J1  11.04,34.03 90 top
J2  77.56,22.92 0 bottom
JP1  57.15,2.54 180 bottom
L1  22.23,45.72 90 bottom
LED1  61.92,33.08 270 top
LED2  61.9,38.05 270 top
Q1  17.77,43.68 90 bottom
Q4  60.07,30.23 270 bottom
R1  66.29,30.1 90 bottom
R2  64.14,30.1 90 bottom
R3  56.39,30.23 270 bottom
R4  59.18,34.93 270 bottom
R5  61.92,31.04 180 top
R6  56.9,34.93 90 bottom
R7  17.2,39.27 90 bottom
R8  19.74,39.27 90 bottom
R9  46.1,24.13 270 bottom
R10  55.62,24.7 270 bottom
R11  52.96,30.23 90 bottom
R12  50.8,30.23 270 bottom
R13  22.42,52.26 90 bottom
R14  70.61,30.1 90 bottom
R15  61.9,36.14 0 top
R16  68.45,30.1 90 bottom
R17  72.77,30.1 90 bottom
R18  66.67,55.88 0 bottom
S4  75.23,49.69 270 bottom
U1  51.11,24.58 180 bottom

### Tracks (layer width: path | path; a pad name or v marks a point on that pad's centre or on a via)
+3V3  (via drill 0.35)
  Top 0.254: J1.15 9.81,32.51 J1.16 | v57.66,31.77 58.04,32.15 v58.04,35.05
  Top 0.406: v8.51,32.51 9.81,32.51 | v15.56,47.82 15.56,51.37 20.45,56.26 26.8,56.26 28.32,57.79 v44.32,57.79 44.32,56.52 46.23,54.61 52.83,54.61 54.74,52.71 v56.13,52.71
  Top 0.61: v58.04,35.05 59.56,35.05 60.07,34.54 68.2,34.54 69.47,33.27 v69.47,32.64
  Bottom 0.254: R3.1 57.09,31.77 v57.66,31.77 | v58.04,35.05 58.76,35.78 R4.1
  Bottom 0.406: 48.9,21.38 C21.2 48.05,21.34 47.26,22.12 | U1.1 53.11,22.25 v53.09,22.23 | R9.2 47.24,22.14 | 47.24,22.14 v47.24,22.1 | 47.26,22.12 47.24,22.14 | U1.6 48.62,23.48 47.26,22.12 | v54.86,21.72 55.62,22.47 R10.2 56.64,24.87 56.64,26.29 54.1,28.83 54.1,31.71 | IC6.2 55.37,17.39 v55.75,17.78 | C20.2 11.07,32.51 v8.51,32.51 7.37,32.51 6.35,31.5 5.33,31.5 4.83,32 4.83,37.34 9.14,41.66 9.14,44.96 10.23,46.04 C11.2 11.96,46.25 12.95,47.24 14.99,47.24 v15.56,47.82 17.4,49.66 23.5,49.66 24.26,48.9 24.26,44.96 23.62,44.32 L1.1 | IC2.2 v44.33,57.79 v44.32,57.79
  Bottom 0.61: R17.2 R14.2 69.47,30.95 | 69.47,30.95 R16.2 | R3.1 55.75,31.71 54.1,31.71 53.59,31.71 R11.2 | R18.1 67.53,54.48 | 67.53,54.48 67.53,52.64 IC1.3 | 67.53,54.48 57.15,54.48 56.13,53.47 v56.13,52.71 56.13,46.99 57.72,45.4 | R4.1 59.18,43.94 57.72,45.4 | C4.1 57.94,45.4 57.72,45.4 | v55.75,17.78 59.69,13.84 59.69,6.48 | 59.69,6.48 JP1.7 | JP1.10 67.31,4.19 65.02,6.48 59.69,6.48 | v69.47,32.64 69.47,30.95
  pour Top: 44.45,23.75 56.77,23.75 56.77,22.23 56.77,17.02 48.01,17.02 44.45,17.02
BOOT
  Bottom 0.254: Q4.3 60.72,32.54 R4.2
  Bottom 0.406: IC2.25 32.38,42.55 33.66,41.28 33.66,39.6 39.86,33.4 55.37,33.4 56.01,32.77 58.04,32.77 59.18,33.91 R4.2
CH_LED_IO25  (via drill 0.35)
  Top 0.254: v48.39,41.28 48.39,36.7 47.24,35.56 47.24,30.35 47.75,29.85 59.88,29.85 R5.2
  Bottom 0.254: IC2.10 48.13,47.63 49,46.76 49,45.06 48.36,44.43 48.36,41.3 v48.39,41.28
DTR  (via drill 0.35)
  Top 0.406: v61.98,28.58 62.97,28.58 v64.14,27.41
  Bottom 0.254: IC3.23 63.54,26.82 v64.14,27.41 | Q4.4 60.72,29.83 60.07,30.48 Q4.2
  Bottom 0.406: Q4.4 61.38,29.18 v61.98,28.58
EN  (via drill 0.35)
  Top 0.254: v58.04,28.45 58.93,29.34 69.34,29.34 72.11,32.11 72.11,40.16 v71.75,40.51
  Bottom 0.254: Q4.6 59.22,29.38 58.04,29.38 | 58.04,29.38 R3.2 | 58.04,29.38 v58.04,28.45 | v71.75,40.51 76.48,45.23 S4.2
  Bottom 0.61: S4.2 74.25,49.66 72.26,49.66 69.98,51.94 69.98,56.64 68.71,57.91 65.79,57.91 | 65.79,57.91 52.58,57.91 51.19,56.52 IC2.3 | R18.2 65.83,57.87 65.79,57.91
EPD_BUSY  (via drill 0.35)
  Top 0.254: v44.07,45.09 31.5,45.09 22.19,35.78 J1.9
  Bottom 0.254: v44.07,45.09 IC2.12
EPD_CLK  (via drill 0.35)
  Top 0.254: J1.13 16,33.78 23.5,33.78 v24.38,34.67
  Bottom 0.254: v24.38,34.67 24.38,38.74 24.74,39.09 24.74,42.71 26.8,44.77 26.8,47.88 27.82,48.9 IC2.30
EPD_CS  (via drill 0.35)
  Top 0.254: v25.15,36.45 22.98,34.28 J1.12
  Bottom 0.254: v25.15,36.45 25.15,42.55 26.42,43.82 IC2.26
EPD_D/C  (via drill 0.35)
  Top 0.254: v44.07,42.55 43.94,42.55 42.22,44.27 31.83,44.27 22.34,34.78 J1.11
  Bottom 0.254: v44.07,42.55 IC2.14
EPD_DIN  (via drill 0.35)
  Top 0.254: J1.14 8.76,33.28 8,34.04 8,35.81 5.71,38.1 5.33,38.1 4.57,38.86 4.57,41.78 19.94,57.15 26.04,57.15 v26.67,57.79
  Bottom 0.254: v26.67,57.79 v26.68,57.79 IC2.37
EPD_RES  (via drill 0.35)
  Top 0.254: v44.07,43.82 43.56,43.82 42.7,44.68 31.66,44.68 22.27,35.28 J1.10
  Bottom 0.254: v44.07,43.82 IC2.13
GA/IMU/RTC_SCL  (via drill 0.35)
  Top 0.254: v44.58,31.75 42.67,33.66 42.67,35.31 39.98,38 39.98,39.06 37.34,41.7 v37.34,43.18
  Top 0.406: v69.98,26.8 69.3,26.12 62.44,26.12 56.52,20.19 52.2,20.19 v51.94,19.94
  Bottom 0.203: IC5.3 29.46,56.64 IC2.36
  Bottom 0.254: 45.59,18.66 44.45,19.81 44.45,25.65 45.34,26.54 45.97,26.54 46.61,27.18 46.61,29.85 44.7,31.75 v44.58,31.75 | v37.34,43.18 37.34,46.1 35.69,47.75 35.69,54.99 33.9,56.77 29.84,56.77 IC2.36
  Bottom 0.406: R10.1 55.52,25.55 54.55,24.58 54.48,24.58 | 54.48,24.58 U1.14 | IC6.16 45.59,18.66 48.51,18.66 49.66,19.81 51.82,19.81 v51.94,19.94 54.48,22.48 54.48,24.58 | R14.1 70.61,27.43 v69.98,26.8
GA/IMU/RTC_SDA  (via drill 0.35)
  Top 0.203: v44.2,48.9 43.69,49.4 43.69,52.2 41.04,54.84 24.91,54.84 v24.77,54.99
  Top 0.254: v49.02,43.82 50.04,42.8 50.04,35.86 50.7,35.2 50.7,33.25 v51.82,32.13
  Top 0.406: v68.45,27.43 68.45,26.92 68.2,26.68 63.11,26.68 62.23,27.56 v53.85,27.56 v45.59,27.56
  Bottom 0.203: IC5.4 23.52,56.24 v24.77,54.99 | v44.2,48.9 IC2.9
  Bottom 0.254: IC2.9 48.13,48.9 49.4,47.63 49.4,44.2 v49.02,43.82 | v51.82,32.13 51.94,32 51.94,30.35 52.92,29.38 R11.1
  Bottom 0.406: U1.13 53.11,27.54 53.09,27.56 | R11.1 52.96,27.69 53.09,27.56 | 53.09,27.56 v53.85,27.56 | v68.45,27.43 R16.1 | v45.59,27.56 44.45,27.56 40.96,24.07 40.96,18.28 41.85,17.39 IC6.15
GDR  (via drill 0.35)
  Top 0.254: J1.2 13.37,39.28 15.49,41.4 v19.43,41.4
  Bottom 0.254: v19.43,41.4 19.74,41.09 R8.2
  Bottom 0.406: Q1.1 19.43,41.62 v19.43,41.4
GND  (via drill 0.35)
  Top 0.254: J1.8 8.8,36.28 v8.26,36.83 | v50.55,32.26 50.29,32.51 50.29,34.67 v49.91,35.05
  Bottom 0.254: C8.2 50.67,36.26 50.67,37.72 51.31,38.35 v51.94,38.35 | R12.1 50.55,31.33 v50.55,32.26
  Bottom 0.305: J2.GND 72.93,21.62 v72.52,21.21
  other vias: 62.36,46.36 57.4,52.58 71.5,43.69 76.58,54.86 44.07,41.28 31.62,59.06 15.88,54.61 14.48,58.67 15.24,37.08 15.24,29.59 55.75,34.93 65.02,32.89 61.98,23.37 60.2,21.84
  pour Top (rank 2, no thermals): -2,70 82,70 82,-3 -2,-3
  pour Bottom (rank 2, no thermals): -3,71 -3,-4 83,-4 83,71
IMU_INT1  (via drill 0.35)
  Top 0.406: v48.26,34.67 v48.26,31.12
  Bottom 0.406: IC2.6 49.14,52.71 50.52,51.34 50.52,41.5 48.26,39.24 v48.26,34.67 | v48.26,31.12 48.72,30.66 48.72,28.34 49.11,27.95 U1.8
IMU_INT2  (via drill 0.35)
  Top 0.406: v49.15,42.55 v49.15,32.13
  Bottom 0.406: U1.9 49.91,27.94 49.28,28.58 49.28,32 v49.15,32.13 | v49.15,42.55 49.91,43.31 49.91,50.17 48.64,51.44 IC2.7
IO39  (via drill 0.35)
  Top 0.254: v51.69,52.45 61.34,42.8 69.72,42.8 71.35,41.17 72.03,41.17 72.52,40.68 v72.52,27.31
  Top 0.406: v55.37,16.13 56.9,16.13 57.91,17.15 57.91,20.7 62.74,25.53 70.74,25.53 v72.52,27.31
  Bottom 0.254: IC2.5 50.16,53.98 v51.69,52.45
  Bottom 0.406: IC6.3 v55.37,16.12 v55.37,16.13 | v72.52,27.31 72.77,27.56 R17.1
N$1  (via drill 0.35)
  Top 0.254: v71.25,22.61 70.36,22.61 69.47,23.5 v69.47,24.77
  Bottom 0.254: J2.D+ 72.83,22.92 72.52,22.61 v71.25,22.61 | v69.47,24.77 67.69,24.77 67.49,24.57 IC3.3
N$2  (via drill 0.35)
  Top 0.406: v72.14,23.37 71.12,23.37 v70.36,24.13
  Bottom 0.254: IC3.4 70.3,24.07 v70.36,24.13
  Bottom 0.406: J2.D- 72.34,23.57 v72.14,23.37
N$3
  Bottom 0.254: IC3.16 59.89,24.57 58.98,25.47 C3.1
N$4
  Bottom 0.203: R13.2 22.42,54.17 23.37,55.12 23.37,55.5 23.03,55.84 IC5.5
N$5  (via drill 0.35)
  Top 0.254: v67.31,22.1 67.31,20.96 v66.67,20.32
  Bottom 0.254: IC3.5 IC3.6 66.97,23.07 67.31,22.73 v67.31,22.1 | v66.67,20.32 65.44,20.32 C7.1
N$6
  Bottom 0.406: R6.2 56.9,36.55 IC4.5
N$7
  Bottom 0.203: IC5.7 17.77,56.24 C5.2
N$8
  Bottom 0.254: IC3.20 62.04,27.16 R2.1
N$9
  Bottom 0.254: IC3.21 62.54,27.08 63.53,28.07 65.79,28.07 66.29,28.58 R1.1
N$10
  Top 0.406: R5.1 60.88,32.94 LED1.A
N$12
  Bottom 0.254: D4.A 22.23,33.31 22.23,41.15 18.64,44.73 Q1.3
  Bottom 0.406: Q1.3 17.77,45.6 17.2,46.17 C18.1 17.2,48.44 17.78,49.02 21.72,49.02 22.23,48.51 L1.2
N$13
  Bottom 0.406: U1.12 52.31,27.32 51.94,27.69 51.18,27.69 50.8,28.07 R12.2
N$14
  Bottom 0.406: U1.7 47.94,24.58 47.54,24.98 R9.1
N$15
  Bottom 0.406: IC6.14 39.31,16.12 35.66,12.47 BATT-CELL.+$2
  Bottom 0.813: BATT-CELL.+$1 14.93,7.62 31.37,7.62 35.66,11.91 35.66,12.47
N$16  (via drill 0.35)
  Top 0.254: v5.46,39.5 7.18,37.78 J1.5
  Bottom 0.406: C10.2 8.32,48.58 5.46,45.72 v5.46,39.5
N$19  (via drill 0.35)
  Top 0.254: v48.39,50.17 52.83,50.17 v54.36,48.64 | v58.17,38.61 58.17,36.96 58.98,36.14 R15.1
  Bottom 0.254: IC2.8 v48.38,50.17 v48.39,50.17 | v54.36,48.64 55.55,47.45 55.55,46.75 58.6,43.7 58.6,39.04 v58.17,38.61
N$20
  Bottom 0.254: C18.2 19.3,47.07 19.3,44.64 22.63,41.32 22.63,30 22.19,29.56 D3.A
  Bottom 0.406: D2.C D3.A
N$21
  Top 0.406: R15.2 LED2.A
N$29  (via drill 0.35)
  Top 0.254: J1.18 8.22,31.28 7.49,32 7.49,35.31 v5.84,36.96
  Bottom 0.254: v5.84,36.96 6.35,37.47 6.35,37.97 11.88,43.5 C12.2
N$30  (via drill 0.35)
  Top 0.254: v5.84,35.69 5.84,34.93 7.09,33.68 7.09,31.84 8.14,30.78 J1.19
  Bottom 0.254: v5.84,35.69 6.86,36.7 6.86,37.91 9.91,40.96 C13.2
N$31  (via drill 0.35)
  Top 0.254: v5.84,33.91 6.6,33.15 6.6,31.5 7.82,30.28 J1.20
  Bottom 0.254: v5.84,33.91 7.26,35.33 7.26,37.11 8.57,38.42 C14.2
N$33  (via drill 0.35)
  Top 0.254: J1.22 6.79,29.28 v5.84,30.23
  Bottom 0.254: v5.84,30.23 6.54,30.93 C15.2
PO_IO2  (via drill 0.35)
  Top 0.406: JP1.1 44.45,9.58 39.27,14.76 39.27,27.89 33.66,33.5 33.66,40.01 v32.51,41.15
  Bottom 0.406: v32.51,41.15 29.72,41.15 IC2.24
PO_IO5  (via drill 0.35)
  Top 0.406: JP1.2 46.99,7.83 39.83,14.99 39.83,28.12 34.42,33.53 v34.42,42.55
  Bottom 0.406: v34.42,42.55 34.42,45.72 32.51,47.63 IC2.29
PO_IO13  (via drill 0.35)
  Top 0.406: JP1.4 52.07,10.8 51,11.86 44.54,11.86 40.95,15.46 40.95,28.78 38.99,30.73 v38.99,35.31
  Bottom 0.406: v38.99,35.31 38.99,35.94 43.06,40.01 IC2.16
PO_IO15  (via drill 0.35)
  Top 0.406: JP1.5 54.61,9.14 51.33,12.42 44.77,12.42 41.5,15.69 41.5,29.11 39.88,30.73 v39.88,32.51
  Bottom 0.406: v39.88,32.51 32.38,40.01 IC2.23
PO_IO19  (via drill 0.35)
  Top 0.406: JP1.3 49.53,9.14 47.37,11.3 44.31,11.3 40.39,15.23 40.39,28.45 35.31,33.53 v35.31,43.31
  Bottom 0.406: v35.31,43.31 35.31,46.1 31.24,50.17 IC2.31
PO_IO21  (via drill 0.35)
  Top 0.406: JP1.6 57.15,11.75 55.92,12.98 45,12.98 42.06,15.92 42.06,29.57 40.77,30.86 40.77,34.67 36.32,39.12 v36.32,42.55
  Bottom 0.406: v36.32,42.55 36.29,42.57 36.29,46.28 32.26,50.32 32.26,51.56 31.11,52.71 IC2.33
PO_IO26  (via drill 0.35)
  Top 0.406: JP1.8 62.23,7.47 56.16,13.54 45.23,13.54 42.62,16.15 42.62,30.15 41.33,31.45 41.33,35.13 38.23,38.23 v38.23,38.48
  Bottom 0.406: v38.23,38.48 40.77,41.02 40.77,45.21 41.91,46.36 IC2.11
PO_IO36  (via drill 0.35)
  Top 0.406: JP1.9 64.77,5.72 56.39,14.1 45.47,14.1 43.18,16.38 43.18,30.48 41.88,31.78 41.88,35.36 39.5,37.75 39.5,38.61 v37.72,40.39
  Bottom 0.406: v37.72,40.39 39.88,42.55 39.88,46.36 42.67,49.15 42.67,53.59 44.33,55.25 IC2.4
PREVGH  (via drill 0.35)
  Top 0.254: v5.84,32.51 6.2,32.16 6.2,31.33 7.75,29.78 J1.21
  Bottom 0.254: v5.84,32.51 6.99,33.66 6.99,34.29 8.57,35.88 C19.2 13.17,34.67 14.86,34.67 17.27,32.26 D4.C
PREVGL  (via drill 0.35)
  Top 0.254: v7.49,28.58 7.7,28.78 J1.23
  Bottom 0.305: C16.2 11.96,27.08 11.94,27.06
  Bottom 0.406: D2.A 11.94,27.06 8.25,27.06 7.49,27.81 v7.49,28.58
RESE  (via drill 0.35)
  Top 0.254: J1.3 13.76,38.78 15.11,40.13 v15.75,40.13
  Bottom 0.254: v15.75,40.13 17.19,40.13 R7.2
  Bottom 0.406: R7.2 17.12,40.2 Q1.2
RTS
  Bottom 0.254: IC3.19 61.54,27.36 61.34,27.56 60.45,27.56 60.07,27.94 Q4.5 60.07,29.85 59.42,30.5 Q4.1
RXD  (via drill 0.35)
  Top 0.254: v65.53,43.69 65.19,43.69 64.66,44.22 64.12,44.22 63.87,43.97 61.51,43.97 53.24,52.24 53.24,52.62 51.76,54.1 45.97,54.1 44.2,55.88 v33.78,55.88
  Bottom 0.254: R1.2 66.29,42.93 v65.53,43.69 | IC2.34 31.88,53.98 v33.78,55.88
TXD  (via drill 0.35)
  Top 0.254: v64.39,43.56 61.34,43.56 52.83,52.07 52.83,52.45 51.69,53.59 45.85,53.59 44.22,55.22 33.51,55.22 33.11,55.63 v31.75,55.63
  Bottom 0.254: R2.2 64.26,30.95 65.79,32.47 65.79,42.16 v64.39,43.56 | v31.75,55.63 31.24,55.12 29.72,55.12 IC2.35
VBATT  (via drill 0.35)
  Top 0.406: v51.44,43.94 50.42,43.94 46.61,47.75 43.31,47.75 42.04,49.02 42.04,52.45 40.26,54.23 v19.68,54.23
  Top 0.61: v53.72,43.94 58.67,43.94 60.96,41.66 v69.09,41.66
  Bottom 0.254: IC5.10 18.86,58.49 C2.1
  Bottom 0.406: v19.68,54.23 18.56,53.11 18.54,53.11
  Bottom 0.61: IC4.3 52.71,40.03 D1.C v51.44,42.29 | BATT_CONN.1 72.39,38.35 v69.09,41.66 69.09,48.26 67.56,49.78 63.5,49.78 62.87,50.42 | 62.87,50.42 62.87,52.58 IC1.1 | C6.1 62.55,50.74 62.87,50.42 | C22.2 18.54,53.11 15.73,53.11 14.22,54.61 14.22,56.77 14.86,57.4 16.89,57.4 17.68,58.19 C2.1
  other vias: 51.44,45.72 53.72,45.72 51.44,40.39 53.72,40.39 52.58,43.94 52.58,45.72
  pour Top: 50.93,43.94 50.93,38.99 53.72,38.99 54.36,38.99 54.36,40.39 54.36,46.48 52.07,46.48 50.93,46.48
VCOM  (via drill 0.35)
  Top 0.254: J1.24 8.47,28.28 8.13,27.94 8.13,26.04 v8.26,25.91
  Bottom 0.254: C17.2 11.9,25.91 v8.26,25.91
VUSB  (via drill 0.35)
  Top 0.305: v54.99,30.73 54.99,36.83 v54.86,36.96
  Bottom 0.305: 62.48,20.7 62.1,21.08 57.66,21.08 57.15,21.59 57.15,26.54 54.99,28.7 v54.99,30.73
  Bottom 0.406: J2.VBUS 71.59,24.22 68.45,21.08 62.87,21.08 62.48,20.7 C1.1 | IC4.1 53.44,36.64 53.91,36.17 C8.1 | v51.94,36.96 52.39,37.4 IC4.1 | v54.86,36.96 54.42,37.4 IC4.1
  Bottom 0.61: D1.A 56.51,39.78 IC4.4 56.86,38.48 v57.02,38.48
  pour Bottom (no thermals): 63.37,22.73 63.37,21.72 63.25,21.59 63.12,21.46 62.74,21.46 61.59,20.32 61.59,20.19 61.59,18.92 63.5,18.92 63.5,20.45 63.63,20.57 64.26,20.57 64.39,20.7 64.39,22.1 64.39,22.73
  pour Top: 50.93,37.72 50.93,33.91 51.05,33.78 57.4,33.78 57.53,33.91 57.53,43.05 57.4,43.18 55.37,43.18 55.24,43.05 55.24,37.97 54.99,37.72

### Text on the board
tPlace: TOP SIDE | 2MM SCREW | ACTIVITY | A | CRG-LED | A | DISPLAY OUTLINE | VERSION: 1.0.1 / 2020/06/18
bPlace: BOTTOM SIDE | A | A | A | A | IO2 | IO5 | IO19 | IO13 | IO15 | IO21 | +3V3 | IO26 | IO36 | +3V3 | GND